# EAGLE schematic waterPumpSystem (EAGLE 8.6.1)
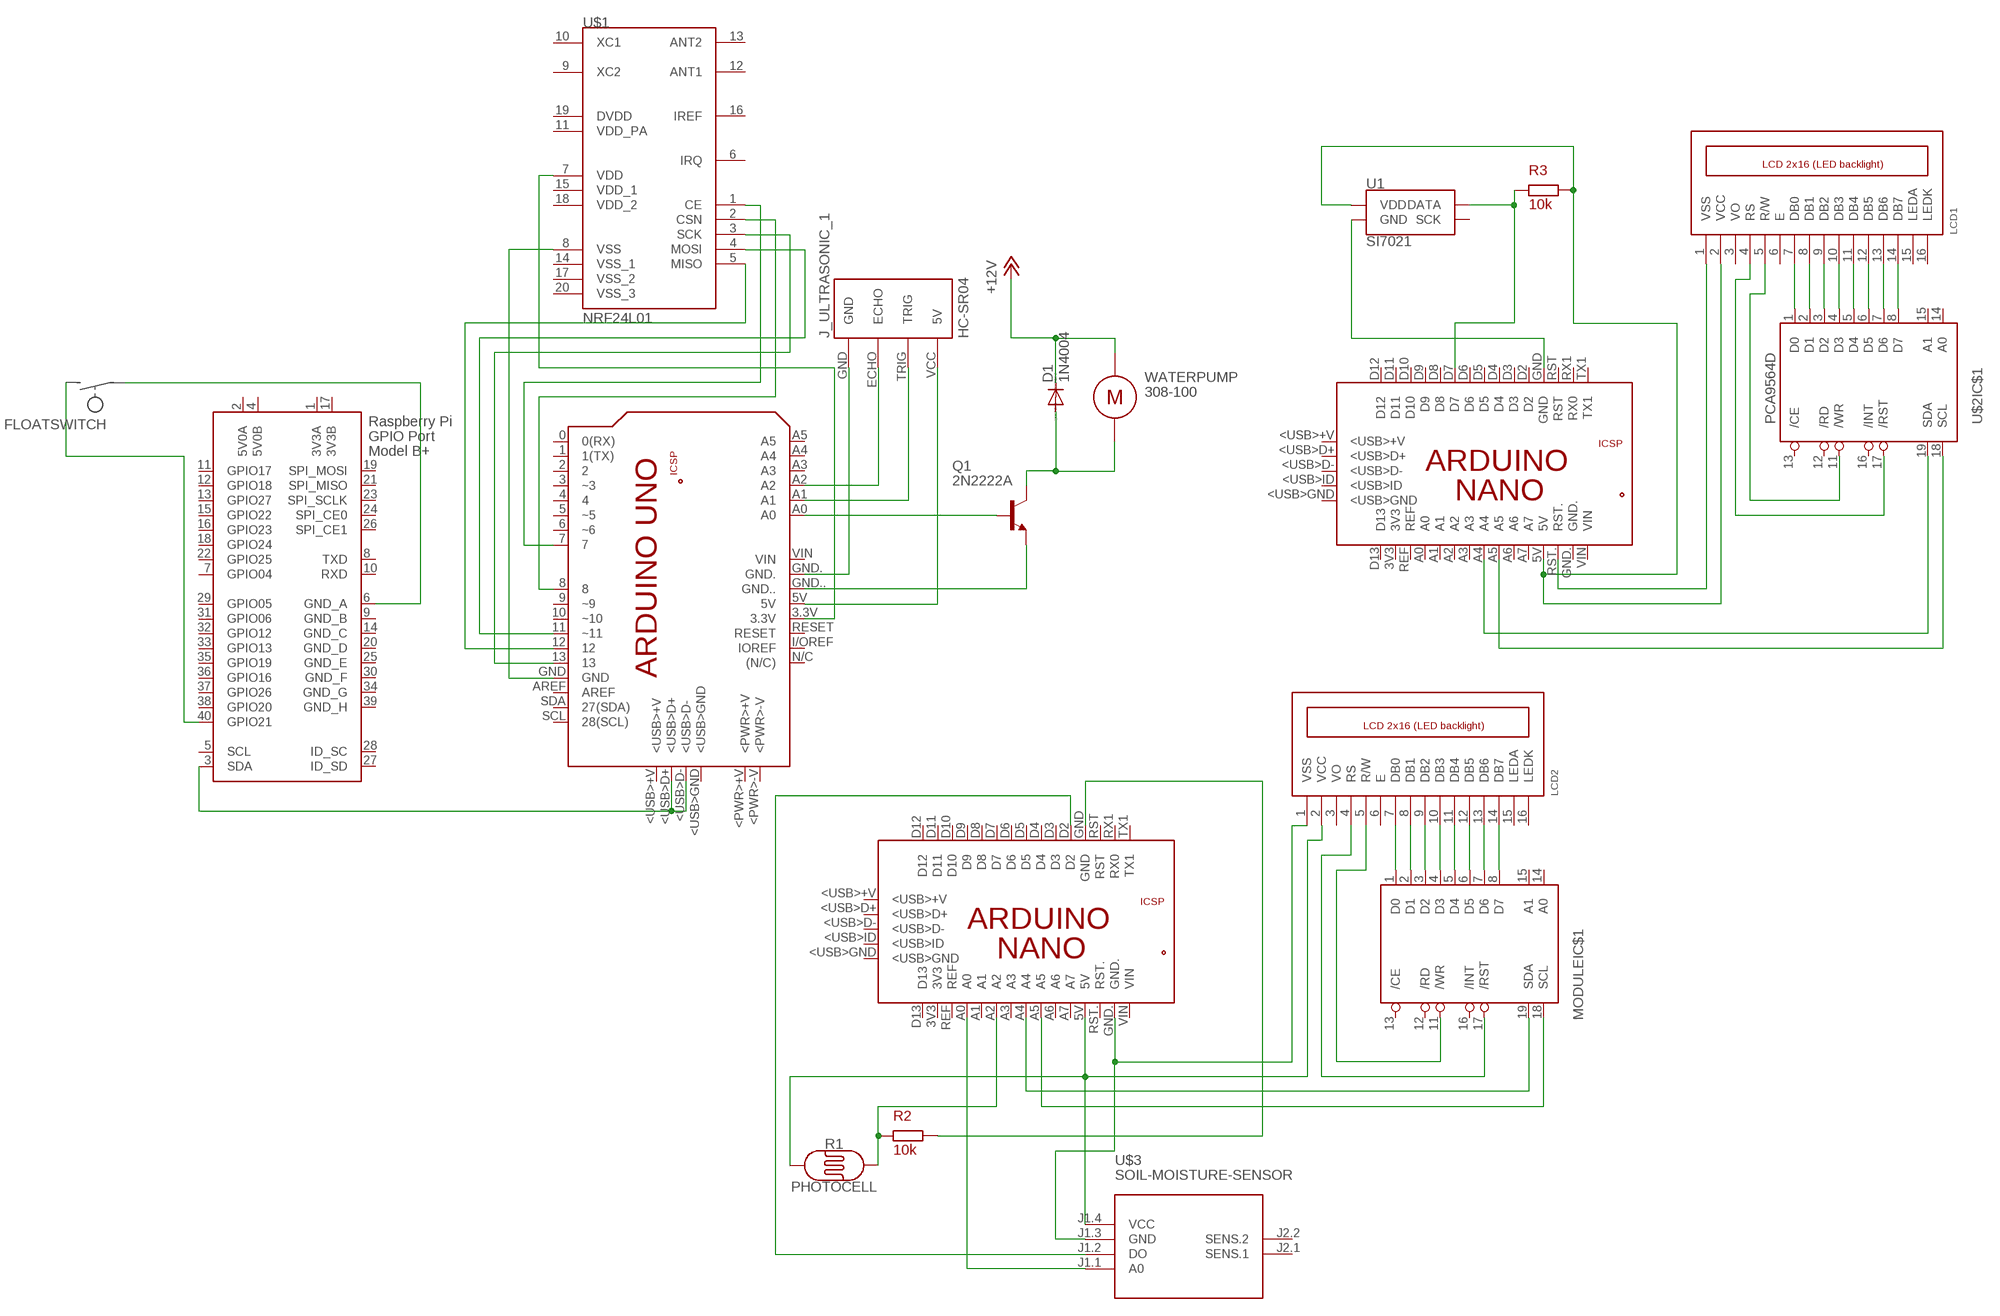
[diagram p0: schematic, sheet 1]

## Parts
D1  1N4004  [DO41-10]
J_ULTRASONIC_1  HC-SR04  [HC-SR04_FOOTPRINT]
LCD1  LCD_2X16_SIL  [HY-1602F]
LCD2  LCD_2X16_SIL  [HY-1602F]
MODULE  PCA9564D  [SO20W]
PCB1  ARDUINO_UNO  [ARDUINO_UNO]
PCB2  ARDUINO_NANO  [ARDUINO_NANO]
PCB3  ARDUINO_NANO  [ARDUINO_NANO]
Q1  2N2222A  [TO18]
R1  PHOTOCELL  PHOTOCELLPTH  [PHOTOCELL]
R2  10k  R  (no package)
R3  10k  R  (no package)
U1  SI7021  [DFN-6-3X3-SI7021]
U$1  NRF24L01  [QFN20]
U$2  PCA9564D  [SO20W]
U$3  SOIL-MOISTURE-SENSOR  [SOIL-MOISTURE-SENSOR]
WATERPUMP  308-100  [308-100]
X1  RASPI_BOARD_B+#_E4  [RASPI_BOARD_B+_EDGES_4DRILL]

## Nets
+12V: D1.C WATERPUMP.POS
N$1: PCB1.<USB>D+ PCB1.<USB>D- X1.3(SDA)
N$2: X1.6(GND_A)
N$3: X1.40(GPIO21)
N$4: J_ULTRASONIC_1.VCC(5V) PCB1.5V
N$5: D1.A Q1.3(C) WATERPUMP.NEG
N$6: PCB1.A0 Q1.2(B)
N$7: PCB1.GND.. Q1.1(E)
N$8: J_ULTRASONIC_1.TRIG PCB1.A1
N$9: J_ULTRASONIC_1.ECHO PCB1.A2
N$10: J_ULTRASONIC_1.GND PCB1.GND.
N$11: PCB1.8 U$1.2(CSN)
N$12: PCB1.7 U$1.1(CE)
N$13: PCB1.GND U$1.8(VSS)
N$14: PCB1.3.3V U$1.7(VDD)
N$15: PCB1.13 U$1.3(SCK)
N$16: PCB1.11(~11) U$1.4(MOSI)
N$17: PCB1.12 U$1.5(MISO)
N$18: PCB2.GND U1.GND
N$19: LCD1.5(R/W) U$2.11(IC$1:/WR)
N$20: LCD1.7(DB0) U$2.1(IC$1:D0)
N$21: PCB2.D7 R3.1 U1.DATA
N$22: LCD1.8(DB1) U$2.2(IC$1:D1)
N$23: LCD1.9(DB2) U$2.3(IC$1:D2)
N$24: LCD1.10(DB3) U$2.4(IC$1:D3)
N$25: LCD1.11(DB4) U$2.5(IC$1:D4)
N$26: LCD1.12(DB5) U$2.6(IC$1:D5)
N$27: LCD1.13(DB6) U$2.7(IC$1:D6)
N$28: LCD1.14(DB7) U$2.8(IC$1:D7)
N$29: LCD1.1(VSS) PCB2.RST.
N$30: LCD1.2(VCC) PCB2.5V R3.2 U1.VDD
N$31: LCD1.4(RS) U$2.17(IC$1:/RST)
N$32: PCB2.A4 U$2.19(IC$1:SDA)
N$33: PCB2.A5 U$2.18(IC$1:SCL)
N$34: LCD2.7(DB0) MODULE.1(IC$1:D0)
N$35: LCD2.8(DB1) MODULE.2(IC$1:D1)
N$36: LCD2.9(DB2) MODULE.3(IC$1:D2)
N$37: LCD2.10(DB3) MODULE.4(IC$1:D3)
N$38: LCD2.11(DB4) MODULE.5(IC$1:D4)
N$39: LCD2.12(DB5) MODULE.6(IC$1:D5)
N$40: LCD2.13(DB6) MODULE.7(IC$1:D6)
N$41: LCD2.14(DB7) MODULE.8(IC$1:D7)
N$42: LCD2.5(R/W) MODULE.11(IC$1:/WR)
N$43: LCD2.4(RS) MODULE.17(IC$1:/RST)
N$44: MODULE.19(IC$1:SDA) PCB3.A4
N$45: MODULE.18(IC$1:SCL) PCB3.A5
N$46: LCD2.2(VCC) PCB3.5V R1.1 U$3.J1.4(VCC)
N$47: LCD2.1(VSS) PCB3.GND. U$3.J1.3(GND)
N$48: PCB3.A2 R1.2 R2.1
N$49: PCB3.GND R2.2
N$50: PCB3.A0 U$3.J1.1(A0)
N$51: PCB3.D2 U$3.J1.2(DO)
Unconnected: LCD1.3(VO) LCD1.6(E) LCD1.15(LEDA) LCD1.16(LEDK) LCD2.3(VO) LCD2.6(E) LCD2.15(LEDA) LCD2.16(LEDK) MODULE.12(IC$1:/RD) MODULE.13(IC$1:/CE) MODULE.14(IC$1:A0) MODULE.15(IC$1:A1) MODULE.16(IC$1:/INT) PCB1.0(0(RX)) PCB1.1(1(TX)) PCB1.2 PCB1.3(~3) PCB1.4 PCB1.5(~5) PCB1.6(~6) PCB1.9(~9) PCB1.10(~10) PCB1.+5V PCB1.<PWR>+V PCB1.<PWR>-V PCB1.<USB>+V PCB1.<USB>GND PCB1.A3 PCB1.A4 PCB1.A5 PCB1.AREF PCB1.GND_ PCB1.I/OREF(IOREF) PCB1.MISO PCB1.MOSI PCB1.N/C((N/C)) PCB1.RESET PCB1.RESET. PCB1.SCK PCB1.SCL(28(SCL)) PCB1.SDA(27(SDA)) PCB1.VIN PCB2.3V3 PCB2.5V. PCB2.<USB>+V PCB2.<USB>D+ PCB2.<USB>D- PCB2.<USB>GND PCB2.<USB>ID PCB2.A0 PCB2.A1 PCB2.A2 PCB2.A3 PCB2.A6 PCB2.A7 PCB2.D2 PCB2.D3 PCB2.D4 PCB2.D5 PCB2.D6 PCB2.D8 PCB2.D9 PCB2.D10 PCB2.D11 PCB2.D12 PCB2.D13 PCB2.GND. PCB2.GND_ PCB2.MISO PCB2.MOSI PCB2.REF PCB2.RESET.. PCB2.RST PCB2.RX1(RX0) PCB2.SCK PCB2.TX1 PCB2.VIN PCB3.3V3 PCB3.5V. PCB3.<USB>+V PCB3.<USB>D+ PCB3.<USB>D- PCB3.<USB>GND PCB3.<USB>ID PCB3.A1 PCB3.A3 PCB3.A6 PCB3.A7 PCB3.D3 PCB3.D4 PCB3.D5 PCB3.D6 PCB3.D7 PCB3.D8 PCB3.D9 PCB3.D10 PCB3.D11 PCB3.D12 PCB3.D13 PCB3.GND_ PCB3.MISO PCB3.MOSI PCB3.REF PCB3.RESET.. PCB3.RST PCB3.RST. PCB3.RX1(RX0) PCB3.SCK PCB3.TX1 PCB3.VIN U1.SCK U$1.6(IRQ) U$1.9(XC2) U$1.10(XC1) U$1.11(VDD_PA) U$1.12(ANT1) U$1.13(ANT2) U$1.14(VSS_1) U$1.15(VDD_1) U$1.16(IREF) U$1.17(VSS_2) U$1.18(VDD_2) U$1.19(DVDD) U$1.20(VSS_3) U$2.12(IC$1:/RD) U$2.13(IC$1:/CE) U$2.14(IC$1:A0) U$2.15(IC$1:A1) U$2.16(IC$1:/INT) U$3.J2.1(SENS.1) U$3.J2.2(SENS.2) X1.5(SCL) X1.7(GPIO04) X1.8(TXD) X1.10(RXD) X1.11(GPIO17) X1.12(GPIO18) X1.13(GPIO27) X1.15(GPIO22) X1.16(GPIO23) X1.18(GPIO24) X1.19(SPI_MOSI) X1.21(SPI_MISO) X1.22(GPIO25) X1.23(SPI_SCLK) X1.24(SPI_CE0) X1.26(SPI_CE1) X1.27(ID_SD) X1.28(ID_SC) X1.29(GPIO05) X1.31(GPIO06) X1.32(GPIO12) X1.33(GPIO13) X1.35(GPIO19) X1.36(GPIO16) X1.37(GPIO26) X1.38(GPIO20)

## Power pins joined to a net without a drawn wire
3V3A: X1.1(3V3A)
3V3B: X1.17(3V3B)
5V0A: X1.2(5V0A)
5V0B: X1.4(5V0B)
GND: MODULE.10(PWR:GND) U$2.10(PWR:GND)
GND_B: X1.9(GND_B)
GND_C: X1.14(GND_C)
GND_D: X1.20(GND_D)
GND_E: X1.25(GND_E)
GND_F: X1.30(GND_F)
GND_G: X1.34(GND_G)
GND_H: X1.39(GND_H)
VCC: MODULE.20(PWR:VCC) U$2.20(PWR:VCC)

## Library data of the parts
D1 = diode:1N4004: DIODE general purpose rectifier, 1 A
J_ULTRASONIC_1 = Ultrasonic Sensor HC-SR04:HC-SR04: Ultrasonic Sensor HC-SR04
LCD1 LCD2 = lcd_2x16_led_backlight:LCD_2X16_SIL
MODULE U$2 = i2c:PCA9564: Parallel Bus to I²C Bus Controller
PCB1 = Arduino_revC:ARDUINO_UNO: Device for representing an Arduino Uno board with a footprint in an EAGLE design. Created by Dave Young for Element14. More EAGLE documentation at: http://www.element14.com/community/community/knode/cadsoft_eagle
PCB2 PCB3 = Arduino_revC:ARDUINO_NANO: Device for representing an Arduino Nano board with a footprint in an EAGLE design. Created by Dave Young for Element14. More EAGLE documentation at: http://www.element14.com/community/community/knode/cadsoft_eagle
Q1 = transistor-npn:2N2222*: NPN Transistor
R1 = SparkFun-Sensors:PHOTOCELL: Photocell (Photodetector, Photo Resistor, CdS) This is a very small light sensor. A photocell changes (also called a photodetector, photo resistor, CdS or photoconductive cell) resistance depending on the amount of light it is exposed to. These little sensors make great ambient light triggers (when light in the room turns on, do something). Datasheet <http://cdn.sparkfun.com/datasheets/Sensors/LightImaging/SEN-09088.pdf> SparkFun Products Mini Photocell <https://www.sparkfun.com/products/9088> (SEN-09088); PROD_ID: COMP-09129; SF_ID: SEN-09088
R2 R3 = ngspice-simulation:R: RESISTOR
U1 = SparkFun-Sensors:SI7021: Silicon Labs Si7021 I2C Humidity and Temperature Sensor The Si7021 is a low-cost, easy-to-use, highly accurate, digital humidity and temperature sensor. This sensor is ideal for environmental sensing and data logging and perfect for build a weather stations or humidor control system. All you need are two lines for I2C communication, and you’ll have relative humidity readings and very accurate temperature readings as a bonus! Datasheet <https://cdn.sparkfun.com/datasheets/Sensors/Weather/Si7021.pdf> SparkFun Products SparkFun Humidity and Temperature Sensor Breakout - Si7021 <https://www.sparkfun.com/products/13763> (SEN-13763) SparkFun Blynk Board - ESP8266 <https://www.sparkfun.com/products/13794> (WRL-13794); PROD_ID: IC-13093
U$1 = nrf24l01:NRF24L01: nRF24L01 Single chip 2.4GHz transceiver from Nordic Semiconductors.
U$3 = diy-modules:SOIL-MOISTURE-SENSOR: Soil Moisture Sensor Click here to find device on ebay.com <http://www.ebay.com/sch/soil+moisture+sensor+arduino>
WATERPUMP = motor:308-100: Pico Vibe 8mm Vibration Motor - 3mm Type; PRECISION_MICRODRIVES: 308-100
X1 = raspberrypi:RASPI_BOARD_B+#: Raspberry Pi GPIO connector with markings for the outer dimensions of the Raspberry Pi board model B+ with different sets of drill holes or mounting pads All pins connected